# Altium project Control_Devices.PrjPcb (part 2 of 3)
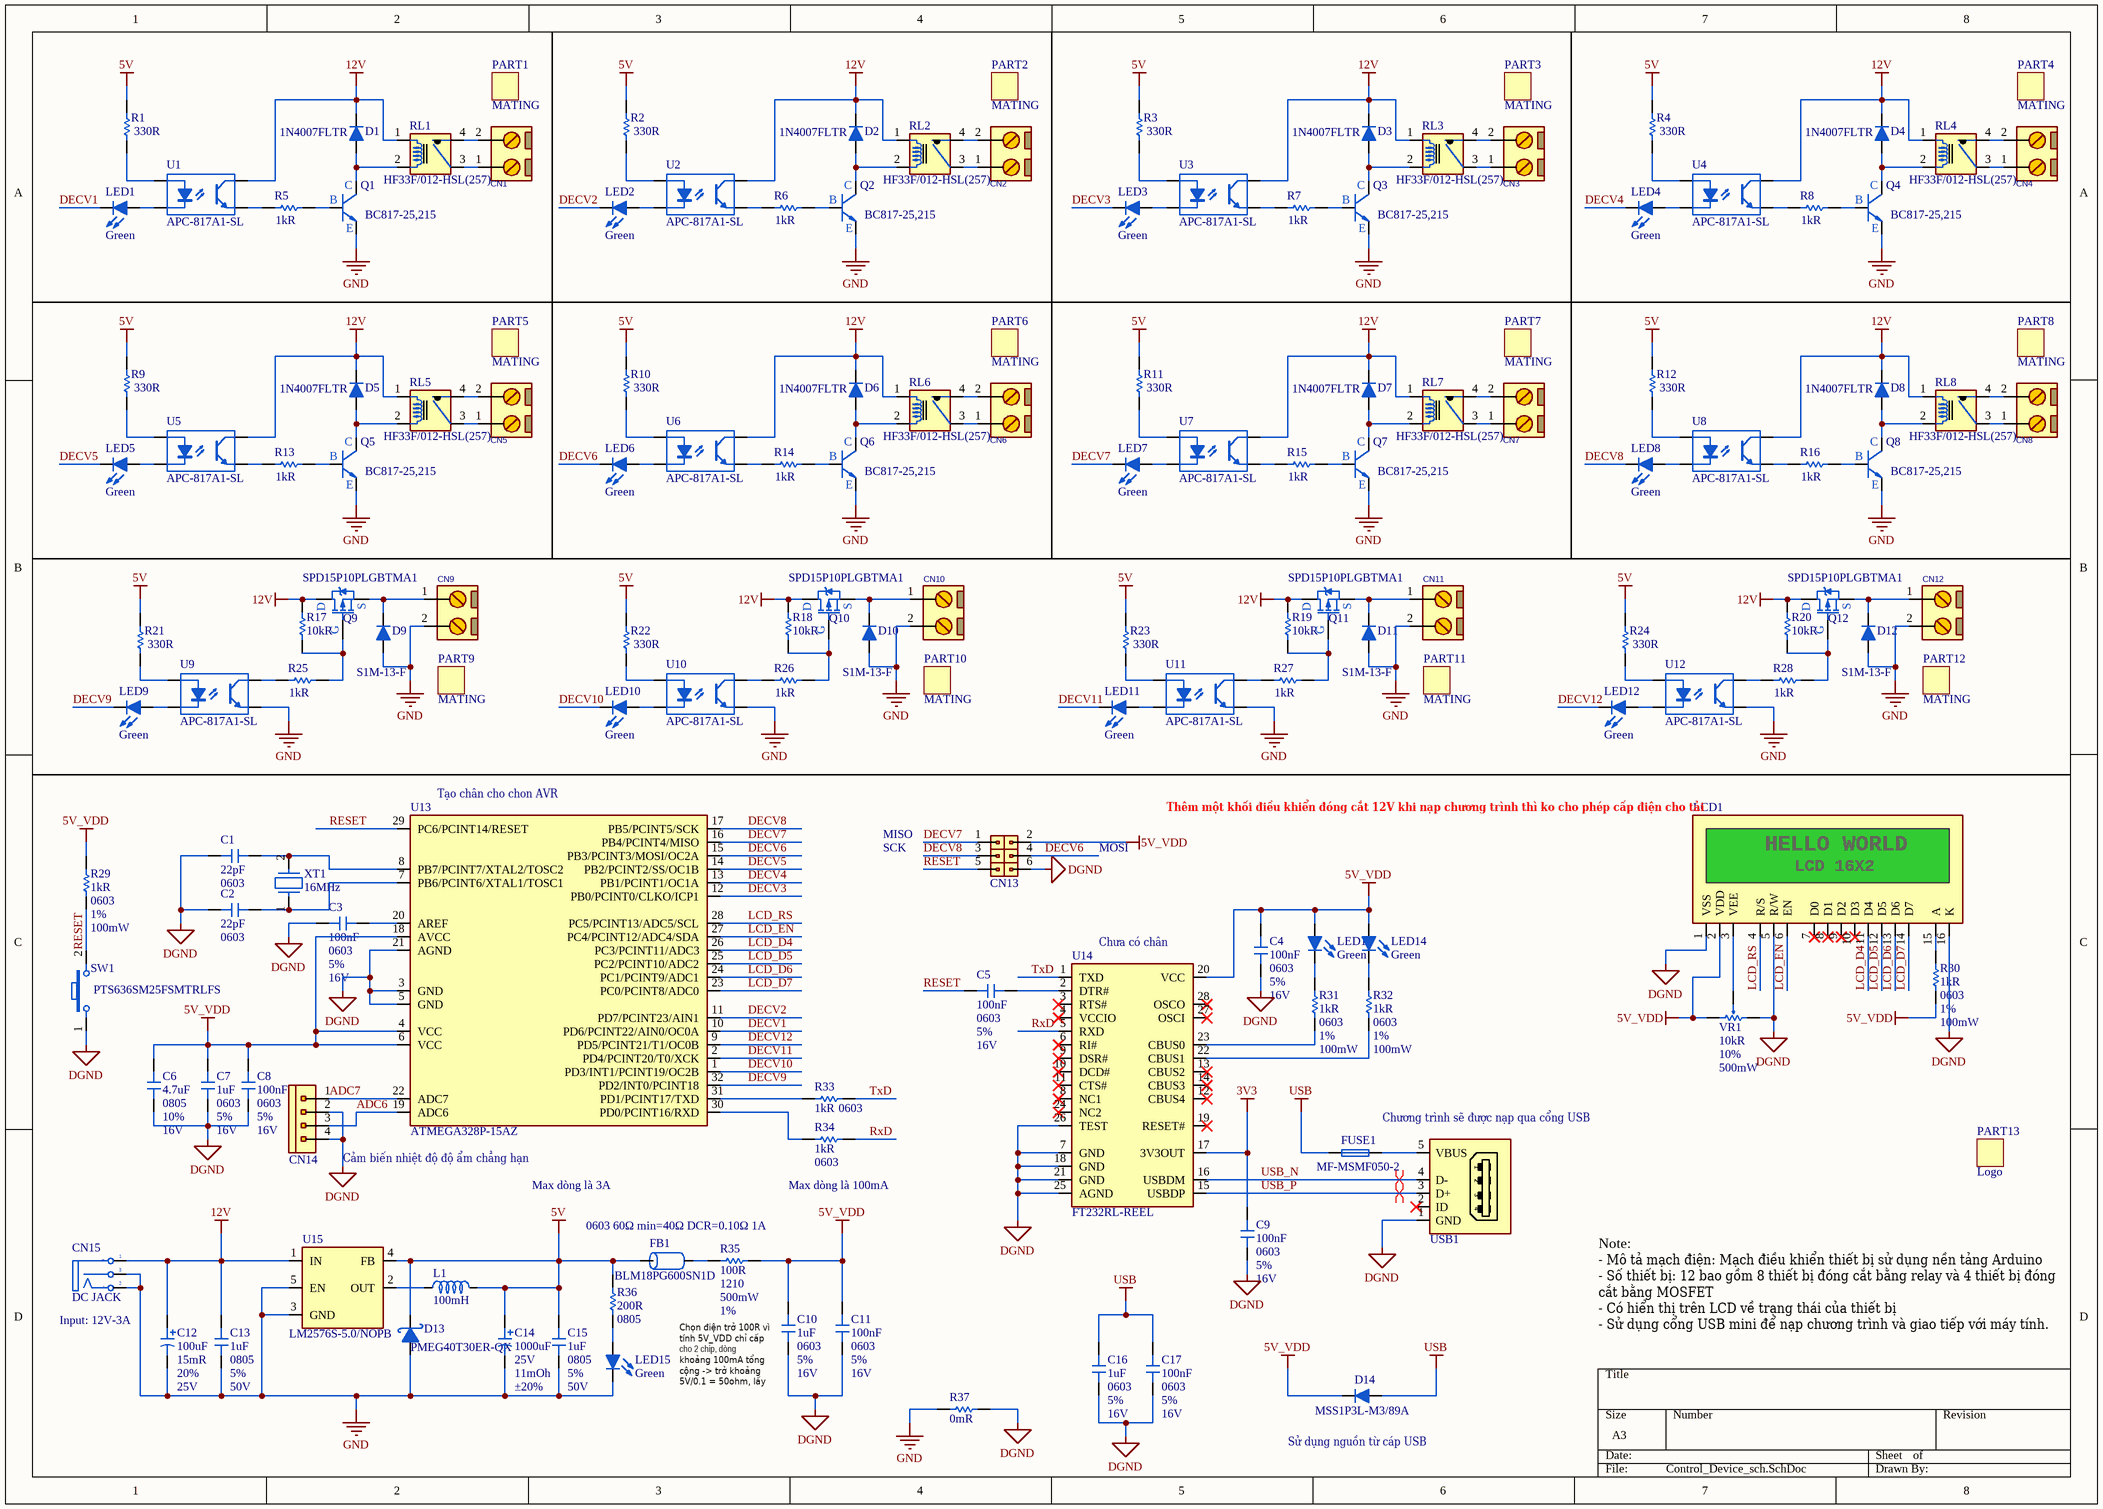
[diagram p1: Control_Device_sch.SchDoc]

## Sheet Control_Device_sch.SchDoc (continued)
### Library data of the parts
C1 C2 = CAP-CER: Surface Mount Ceramic Multilayer Capacitor 22pF 5% C0G 50V 0603 Paper T/R; Manufacturer: Yageo; Manufacturer Part Number: CC0603JRNPO9BN220; Temperature Coefficient: 30ppm/°C; Creator: hoangpt; Publish: 25-Oct-2021; Supplier 1: Future Electronics; Supplier Part Number 1: 2031987; RoHS: Yes; Category: Ceramic Capacitors; Stock 1: 6000000; Pricing 1: 4000=0.0041, 16000=0.0039, 80000=0.0036, 160000=0.0035, 500000=0.0033 (USD); Mount: Surface Mount; Number of Pins: 2; Case Code (Imperial): 0603; Case Code (Metric): 1608; Min Operating Temperature: -55°C; Max Operating Temperature: 125°C; Tolerance: 5%; Capacitance: 22pF; Dielectric: C0G; Voltage Rating: 50V; Voltage Rating (DC): 50V; Packaging: Tape and Reel; Package Quantity: 1; Termination: SMD/SMT; Voltage: 50V; Series: CC; Length: 1.6mm; Width: 0.031inch; Height: 0.8mm; Thickness: 0.035inch; Depth: 0.8mm; Radiation Hardening: No; Reach SVHC Compliant: No; Lead Free: Lead Free; RoHS Compliant: Yes; ComponentLink1URL: https://datasheet.ciiva.com/11786/0900766b8079c870-11786216.pdf?src-supplier=Rs; ComponentLink1Description: https://datasheet.ciiva.com/11786/0900766b8079c870-11786216.pdf?src-supplier=Rs; ComponentLink2URL: https://datasheet.ciiva.com/28450/1443161-28450487.pdf?src-supplier=Element14; ComponentLink2Description: https://datasheet.ciiva.com/28450/1443161-28450487.pdf?src-supplier=Element14; ComponentLink3URL: https://datasheet.ciiva.com/46430/1835847-46430153.pdf?src-supplier=Element14; ComponentLink3Description: https://datasheet.ciiva.com/46430/1835847-46430153.pdf?src-supplier=Element14; ComponentLink4URL: https://datasheet.ciiva.com/144/mlccorderingcode-144632.pdf?src-supplier=Digi-Key; ComponentLink4Description: https://datasheet.ciiva.com/144/mlccorderingcode-144632.pdf?src-supplier=Digi-Key; ComponentLink5URL: https://datasheet.ciiva.com/144/mlccorderingcode-144631.pdf?src-supplier=Digi-Key; ComponentLink5Description: https://datasheet.ciiva.com/144/mlccorderingcode-144631.pdf?src-supplier=Digi-Key; ComponentLink6URL: https://datasheet.ciiva.com/144/mlccorderingcode-144633.pdf?src-supplier=Digi-Key; ComponentLink6Description: https://datasheet.ciiva.com/144/mlccorderingcode-144633.pdf?src-supplier=Digi-Key; ComponentLink7URL: https://datasheet.ciiva.com/8033/1734582-8033749.pdf?src-supplier=Element14; ComponentLink7Description: https://datasheet.ciiva.com/8033/1734582-8033749.pdf?src-supplier=Element14; ComponentLink8URL: https://datasheet.ciiva.com/11464/upy-gp-np0-16v-to-50v-8-11464728.pdf?src-supplier=Avnet; ComponentLink8Description: https://datasheet.ciiva.com/11464/upy-gp-np0-16v-to-50v-8-11464728.pdf?src-supplier=Avnet
C3-C5 C8 C9 C11 C17 = CAP-CER: Cap Ceramic 0.1uF 16V X7R 5% SMD 0603 125C T/R; Manufacturer: Yageo; Manufacturer Part Number: CC0603JRX7R7BB104; Creator: hoangpt; Publish: 25-Oct-2021; Supplier 1: Future Electronics; Supplier Part Number 1: 5822184; RoHS: Yes; Category: Ceramic Capacitors; Stock 1: 28000; Pricing 1: 4000=0.0077, 16000=0.0073, 60000=0.007, 120000=0.0068, 300000=0.0065 (USD); Mount: Surface Mount; Number of Pins: 2; Case Code (Metric): 1608; Case Code (Imperial): 0603; Min Operating Temperature: -55°C; Max Operating Temperature: 125°C; Capacitance: 100nF; Packaging: Tape and Reel; Dielectric: X7R; Voltage Rating (DC): 16V; Series: CC; Length: 0.063inch; Width: 0.031inch; Thickness: 0.035inch; Depth: 0.8mm; Radiation Hardening: No; Lead Free: Lead Free; Halogen Free: Halogen Free; RoHS Compliant: Yes; ComponentLink1URL: https://datasheet.ciiva.com/26862/getdatasheetpartid-403543-26862779.pdf?src-supplier=Verical; ComponentLink1Description: https://datasheet.ciiva.com/26862/getdatasheetpartid-403543-26862779.pdf?src-supplier=Verical
C6 = CAP-CER: 0805 4.7 uF 16 V ±10% Tolerance X5R Multilayer Ceramic Capacitor; Manufacturer: Yageo; Manufacturer Part Number: CC0805KKX5R7BB475; Creator: hoangpt; Publish: 25-Oct-2021; Supplier 1: Future Electronics; Supplier Part Number 1: 8039217; RoHS: Yes; Category: Ceramic Capacitors; Stock 1: 6000; Pricing 1: 3000=0.0693, 6000=0.0675, 9000=0.0665, 15000=0.0652, 30000=0.0625 (USD); Mount: Surface Mount; Case Code (Imperial): 0805; Case Code (Metric): 2012; Min Operating Temperature: -55°C; Max Operating Temperature: 85°C; Capacitance: 4.7uF; Dielectric: X5R; Voltage Rating (DC): 16V; Packaging: Tape and Reel; Termination: SMD/SMT; Dissipation Factor: 10%; Series: CC; Construction: Flat; Length: 2mm; Width: 0.049inch; Height: 1.25mm; Thickness: 0.057inch; Depth: 1.25mm; Radiation Hardening: No; Lead Free: Lead Free; Halogen Free: Halogen Free; RoHS Compliant: Yes; ComponentLink1URL: http://www.mouser.com/ds/2/447/UPY-GPHC_X5R_4V-to-50V_24-1109650.pdf?src-supplier=Mouser; ComponentLink1Description: http://www.mouser.com/ds/2/447/UPY-GPHC_X5R_4V-to-50V_24-1109650.pdf?src-supplier=Mouser; ComponentLink2URL: http://www.yageo.com/documents/recent/UPY-GPHC_X5R_4V-to-50V_25.pdf?src-supplier=Digi-Key; ComponentLink2Description: http://www.yageo.com/documents/recent/UPY-GPHC_X5R_4V-to-50V_25.pdf?src-supplier=Digi-Key; ComponentLink3URL: https://www.yageo.com/upload/media/product/productsearch/datasheet/mlcc/UPY-GPHC_X5R_4V-to-50V_26.pdf?src-supplier=Digi-Key; ComponentLink3Description: https://www.yageo.com/upload/media/product/productsearch/datasheet/mlcc/UPY-GPHC_X5R_4V-to-50V_26.pdf?src-supplier=Digi-Key; ComponentLink4URL: http://www.yageo.com/documents/recent/UPY-GPHC_X5R_4V-to-50V_12.pdf?src-supplier=Avnet; ComponentLink4Description: http://www.yageo.com/documents/recent/UPY-GPHC_X5R_4V-to-50V_12.pdf?src-supplier=Avnet
C7 C10 C16 = CAP-CER: Cap Ceramic 1uF 16V X7R 5% SMD 0603 125°C Paper T/R; Manufacturer: Yageo; Manufacturer Part Number: CC0603JRX7R7BB105; Creator: hoangpt; Publish: 25-Oct-2021; Supplier 1: Arrow Electronics; Supplier Part Number 1: CC0603JRX7R7BB105; RoHS: Yes; Category: Ceramic Capacitors; Stock 1: 1536; Pricing 1: 1=0.2145, 10=0.0953, 25=0.094, 100=0.0576, 250=0.057, 500=0.0534, 1000=0.0487 (USD); Mount: Surface Mount; Case Code (Imperial): 0603; Case Code (Metric): 1608; Min Operating Temperature: -55°C; Max Operating Temperature: 125°C; Packaging: Tape and Reel; Capacitance: 1uF; ComponentLink1URL: http://www.yageo.com/documents/recent/UPY-GPHC_X7R_6.3V-to-50V_18.pdf?src-supplier=Digi-Key; ComponentLink1Description: http://www.yageo.com/documents/recent/UPY-GPHC_X7R_6.3V-to-50V_18.pdf?src-supplier=Digi-Key; ComponentLink2URL: https://www.yageo.com/upload/media/product/productsearch/datasheet/mlcc/UPY-GPHC_X7R_6.3V-to-50V_18.pdf?src-supplier=Digi-Key; ComponentLink2Description: https://www.yageo.com/upload/media/product/productsearch/datasheet/mlcc/UPY-GPHC_X7R_6.3V-to-50V_18.pdf?src-supplier=Digi-Key
C12 = CAP-ELEC: Cap Aluminum Polymer 100uF 25VDC 20% (10 X 12.5mm) Radial 5mm 0.015 Ohm 4500mA 2000h 105C T/R; Manufacturer: Nichicon; Manufacturer Part Number: RNS1E101MDN1PH; Ripple Current: 4.5A; Leakage Current: 500uA; Dissipation Factor: 0.08%; Creator: hoangpt; Publish: 25-Oct-2021; Supplier 1: Arrow Electronics; Supplier Part Number 1: RNS1E101MDN1PH; RoHS: Yes; Category: Polymer Capacitors; Stock 1: 27; Pricing 1: 1=2.502, 10=2.231, 25=2.08 (USD); Mount: Through Hole; Case/Package: Radial; Min Operating Temperature: -55°C; Max Operating Temperature: 105°C; Capacitance: 100uF; Packaging: Tape and Reel; Package Quantity: 1; Voltage Rating (DC): 25V; Termination: Radial; Series: FPCAP, NS; Diameter: 10mm; Length: 12.5mm; Height: 12.5mm; Lead Pitch: 5mm; Height - Seated (Max): 0.551inch; Reach SVHC Compliant: No; RoHS Compliant: Yes; ComponentLink1URL: https://datasheet.ciiva.com/6298/2012fpcap-catalog-all-6298659.pdf?src-supplier=Digi-Key; ComponentLink1Description: https://datasheet.ciiva.com/6298/2012fpcap-catalog-all-6298659.pdf?src-supplier=Digi-Key; ComponentLink2URL: https://datasheet.ciiva.com/12554/2012fpcap-catalog-ns-6061-12554509.pdf?src-supplier=Mouser; ComponentLink2Description: https://datasheet.ciiva.com/12554/2012fpcap-catalog-ns-6061-12554509.pdf?src-supplier=Mouser; ComponentLink3URL: https://datasheet.ciiva.com/28458/1913247-28458902.pdf?src-supplier=Element14; ComponentLink3Description: https://datasheet.ciiva.com/28458/1913247-28458902.pdf?src-supplier=Element14; ComponentLink4URL: https://datasheet.ciiva.com/6300/e-ns-6300664.pdf?src-supplier=Digi-Key; ComponentLink4Description: https://datasheet.ciiva.com/6300/e-ns-6300664.pdf?src-supplier=Digi-Key
C13 C15 = CAP-CER: 0805 1 uF 50 V ±5 % Tolerance X7R Surface Mount Multilayer Ceramic Capacitor; Manufacturer: Yageo; Manufacturer Part Number: CC0805JKX7R9BB105; Creator: hoangpt; Publish: 25-Oct-2021; Supplier 1: Arrow Electronics; Supplier Part Number 1: CC0805JKX7R9BB105; RoHS: Yes; Category: Ceramic Capacitors; Stock 1: 1222; Pricing 1: 1=0.1748, 10=0.125, 25=0.1071, 100=0.0806, 250=0.0799, 500=0.0711, 1000=0.0631 (USD); Mount: Surface Mount; Case Code (Imperial): 0805; Case Code (Metric): 2012; Min Operating Temperature: -55°C; Max Operating Temperature: 125°C; Packaging: Cut Tape; Capacitance: 1uF; Series: CC; ComponentLink1URL: http://www.yageo.com/documents/recent/UPY-GPHC_X7R_6.3V-to-50V_18.pdf?src-supplier=Digi-Key; ComponentLink1Description: http://www.yageo.com/documents/recent/UPY-GPHC_X7R_6.3V-to-50V_18.pdf?src-supplier=Digi-Key
C14 = CAP-ELEC: Cap, 1000Uf, 25V, Alu Elec, Hybrid, Rad Rohs Compliant: Yes; Manufacturer: Panasonic; Manufacturer Part Number: EEHAZSE102UB; Lifetime @ Temp.: 4000 Hrs @ 125°C; Creator: hoangpt; Publish: 25-Oct-2021; Supplier 1: Digi-Key; Supplier Part Number 1: 10-EEH-AZSE102UBCT-ND; RoHS: Yes; Category: Polymer Capacitors; Pricing 1: 1=2.92, 10=2.361, 50=2.06, 100=1.8026 (USD); Capacitance: 1000uF; Lead Spacing: 0.197" (5.00mm); Size / Dimension: 0.394" Dia (10.00mm); Height - Seated (Max): 0.657" (16.70mm)
CN1-CN12 = CONN_PWR_2P: Conn Shrouded Header (2 Sides) M 2 POS 5mm Solder RA Side Entry Thru-Hole Box; Manufacturer: TE Connectivity; Manufacturer Part Number: 282812-2; Number of Positions: 2; Number of Levels: 1; Current: 15A; Voltage: 300V; Shrouded: Yes (With); Interlock: No (Without); Tail Length: 3.5mm; Creator: hoangpt; Publish: 25-Oct-2021; Supplier 1: Mouser; Supplier Part Number 1: 571-282812-2; RoHS: Yes; Category: Uncategorized; Stock 1: 1; Pricing 1: 1=1.06, 10=0.663, 50=0.663, 100=0.499, 1000=0.403, 10000=0.282 (USD); Mount: Through Hole; Contact Plating: Tin; Color: Green; Contact Material: Copper Alloy; Housing Color: Green; Housing Material: Polyamide; Min Operating Temperature: -40°C; Max Operating Temperature: 110°C; Termination: Solder; Packaging: Box; Series: Buchanan; Number of Rows: 1; Package Quantity: 300; Number of Positions Per Level: 2; Number of Contacts: 2; Current Rating: 15A; Voltage Rating (AC): 300V; Orientation: Right Angle; Connector Type: Header; Max Current Rating: 15A; Screw Flange: No (Without); Screwless Terminal Block: No (Without); Side Stackable: No (Without); Closed End: No (Without); Max Voltage Rating (AC): 300V; Number of Poles: 2; Length: 10mm; Pitch: 5mm; Depth: 12mm; Radiation Hardening: No; Flammability Rating: UL94 V-0; RoHS Compliant: Yes; ELV: Compliant; Lead Free: Lead Free; ComponentLink1URL: https://datasheet.ciiva.com/16308/282812-2-16308394.pdf?src-supplier=Future+Electronics; ComponentLink1Description: https://datasheet.ciiva.com/16308/282812-2-16308394.pdf?src-supplier=Future+Electronics; ComponentLink2URL: https://datasheet.ciiva.com/30206/eng-cs-1308389-eurostyle-terminal-blocks-0607-30206889.pdf?src-supplier=Onlinecomponents.com; ComponentLink2Description: https://datasheet.ciiva.com/30206/eng-cs-1308389-eurostyle-terminal-blocks-0607-30206889.pdf?src-supplier=Onlinecomponents.com; ComponentLink3URL: https://datasheet.ciiva.com/796/eng-cd-282812-d4-796877.pdf?src-supplier=Digi-Key; ComponentLink3Description: https://datasheet.ciiva.com/796/eng-cd-282812-d4-796877.pdf?src-supplier=Digi-Key; ComponentLink4URL: https://datasheet.ciiva.com/18456/eng-cd-282812-d4-18456709.pdf?src-supplier=Digi-Key; ComponentLink4Description: https://datasheet.ciiva.com/18456/eng-cd-282812-d4-18456709.pdf?src-supplier=Digi-Key
CN13 = CONN_FM_2X3P: CONN HEADER VERT 6POS 2.54MM; Manufacturer: Sullins; Number of Positions: 6; Gender: Male; Creator: hoangpt; Publish: 19-May-2023; Supplier 1: Digi-Key; Supplier Part Number 1: S2012E-03-ND; Manufacturer Part Number: PEC03DAAN; RoHS: Yes; Category: Connectors; Stock 1: 8642; Pricing 1: 1=0.35, 10=0.329, 25=0.282, 50=0.2398, 100=0.2303, 250=0.2068, 500=0.1974 (USD); Mount: Through Hole; Housing Color: Black; Contact Material: Bronze; Housing Material: Plastic; Contact Shape: Square; Contact Finish - Mating: TIN; Insulation Material: PBT; Insulation Color: Black; Min Operating Temperature: -65°C; Max Operating Temperature: 125°C; Number of Rows: 2; Packaging: Bulk; Termination: Solder; Number of Contacts: 6; Series: -; Contact Type: Male Pin; Fastening Type: Pull; Length: 7.62mm; Width: 5.08mm; Height: 2.54mm; Pitch: 2.54mm; Lead Free: Lead Free; RoHS Compliant: Yes; Flammability Rating: UL94 V-0; ComponentLink1URL: https://datasheet.ciiva.com/6889/pxcxxdxxn-dwg-6889261.pdf?src-supplier=Digi-Key; ComponentLink1Description: https://datasheet.ciiva.com/6889/pxcxxdxxn-dwg-6889261.pdf?src-supplier=Digi-Key
CN14 = CONN_JP_4P: PEC Series Single Row 4 Position 2.54 mm Straight Breakaway Header; Manufacturer: Sullins; Manufacturer Part Number: PEC04SAAN; Number of Positions: 4; Gender: Male; Pitch: 2.54mm; Creator: hoangpt; Publish: 29-Oct-2021; Supplier 1: Digi-Key; Supplier Part Number 1: S1012E-04-ND; RoHS: Yes; Category: Connectors; Stock 1: 3558; Pricing 1: 1=0.27, 10=0.257, 25=0.22, 50=0.187, 100=0.1797, 250=0.16132, 500=0.154 (USD); Mount: Through Hole; Housing Color: Black; Contact Material: Bronze; Housing Material: Plastic; Contact Shape: Square; Contact Finish - Mating: TIN; Insulation Material: PBT; Insulation Color: Black; Min Operating Temperature: -65°C; Max Operating Temperature: 125°C; Number of Rows: 1; Packaging: Bulk; Termination: Solder; Number of Contacts: 4; Contact Type: Male Pin; Fastening Type: Pull; Series: -; Length: 10.2mm; Width: 2.54mm; Height: 2.54mm; Lead Free: Lead Free; RoHS Compliant: Yes; Flammability Rating: UL94 V-0; ComponentLink1URL: https://s3.amazonaws.com/catalogspreads-pdf/PAGE112-113%20.100%20MALE%20HDR.pdf?src-supplier=Digi-Key; ComponentLink1Description: https://s3.amazonaws.com/catalogspreads-pdf/PAGE112-113%20.100%20MALE%20HDR.pdf?src-supplier=Digi-Key; ComponentLink2URL: http://www.sullinscorp.com/catalogs/97_Page78-79_HEADER_.100_2.54mm_MALE_BREAKAWAY.pdf?src-supplier=Future+Electronics; ComponentLink2Description: http://www.sullinscorp.com/catalogs/97_Page78-79_HEADER_.100_2.54mm_MALE_BREAKAWAY.pdf?src-supplier=Future+Electronics
CN15 = DC_JACK: 2.0 x 6.5 mm, 2.5 A, Horizontal, Through Hole, Dc Power Jack Connector; Manufacturer: CUI; Manufacturer Part Number: PJ-002A; Shielding: Unshielded; Number of Conductors: 2; Supplier 1: Arrow Electronics; Supplier Part Number 1: PJ-002A; RoHS: Yes; Category: Uncategorized; Stock 1: 1489; Pricing 1: 1=0.596300, 10=0.590400, 25=0.566500, 50=0.534000, 100=0.492400, 250=0.431500, 500=0.406900, 1000=0.341800, 2500=0.292100 (USD); Connector Type: Jack; Termination: Through Hole; Packaging: Bulk; Orientation: Horizontal; Diameter: 2.1mm; Lead Free: Lead Free; RoHS Compliant: Yes; ComponentLink1URL: http://www.mouser.com/ds/2/670/pj-002a-515880.pdf?src-supplier=Mouser; ComponentLink1Description: http://www.mouser.com/ds/2/670/pj-002a-515880.pdf?src-supplier=Mouser; ComponentLink2URL: http://www.cui.com/Product/Resource/FuturePDF/PJ-002A.pdf?src-supplier=Future+Electronics; ComponentLink2Description: http://www.cui.com/Product/Resource/FuturePDF/PJ-002A.pdf?src-supplier=Future+Electronics; ComponentLink3URL: https://www.cui.com/product/resource/digikeypdf/pj-002a.pdf?src-supplier=Digi-Key; ComponentLink3Description: https://www.cui.com/product/resource/digikeypdf/pj-002a.pdf?src-supplier=Digi-Key
D1-D8 = DIODE: Standard Rectifier 1000V SOD-123; Manufacturer: SMC; Creator: hoangpt; Publish: 25-Oct-2021; Supplier 1: Future Electronics; Supplier Part Number 1: 8135663; Manufacturer Part Number: 1N4007FLTR; RoHS: No; Stock 1: 240000; Pricing 1: 3000=0.0145, 12000=0.0138, 45000=0.0133, 90000=0.013, 225000=0.0124 (USD)
D9-D12 = DIODE: VR=1000V IF=1A 10pF Trr=3us; Manufacturer: Diodes; Forward Current: 1A; Max Repetitive Reverse Voltage (Vrrm): 1kV; Max Reverse Current: 5uA; Peak Non-Repetitive Surge Current: 30A; Reverse Recovery Time: 3us; Polarity: Standard; Forward Voltage: 1.1V; Recovery Time: 1.8us; Creator: hoangpt; Publish: 25-Oct-2021; Supplier 1: Future Electronics; Supplier Part Number 1: 3385689; Manufacturer Part Number: S1M-13-F; RoHS: Yes; Category: Rectifier Diodes; Stock 1: 4194; Pricing 1: 1=0.192, 20=0.14, 100=0.112, 500=0.0842, 2500=0.0563 (USD); Case/Package: SMA; Number of Pins: 2; Weight: 0.002258oz; Min Operating Temperature: -65°C; Max Operating Temperature: 150°C; Packaging: Tape and Reel; Max Forward Surge Current (Ifsm): 30A; Package Quantity: 5000; Average Rectified Current: 1A; Voltage Rating (DC): 1kV; Current Rating: 1A; Output Current: 1A; Max Reverse Voltage (DC): 1kV; Series: -; Capacitance: 10pF; Reverse Voltage (DC): 1kV; Termination: SMD/SMT; Length: 4.6mm; Width: 2.92mm; Height: 2.1mm; Radiation Hardening: No; Reach SVHC Compliant: No; Lead Free: Lead Free; RoHS Compliant: Yes; ComponentLink1URL: https://datasheet.ciiva.com/34302/1541642-34302418.pdf?src-supplier=Jameco; ComponentLink1Description: https://datasheet.ciiva.com/34302/1541642-34302418.pdf?src-supplier=Jameco; ComponentLink2URL: https://datasheet.ciiva.com/22695/1911706-22695834.pdf?src-supplier=Element14; ComponentLink2Description: https://datasheet.ciiva.com/22695/1911706-22695834.pdf?src-supplier=Element14
D13 = DIODE_SCHOTTKY: PMEG40T30ER-Q - 40 V, 3 A low Trench MEGA Schottky barrier rectifier; Manufacturer: Nexperia; Creator: hoangpt; Publish: 25-Oct-2021; Supplier 1: Digi-Key; Supplier Part Number 1: 1727-PMEG40T30ER-QXCT-ND; Manufacturer Part Number: PMEG40T30ER-QX; RoHS: No; Category: Uncategorized; Stock 1: 2765; Pricing 1: 1=0.43, 10=0.349, 100=0.2373, 500=0.17798, 1000=0.13349 (USD)
D14 = DIODE: VR=30V IF=1A 65pF; Manufacturer: Vishay Semiconductors; Max Surge Current: 25A; Average Rectified Current: 1A; Max Reverse Voltage (DC): 30V; Max Reverse Current: 250uA; Forward Voltage: 500mV; Creator: hoangpt; Publish: 25-Oct-2021; Supplier 1: Mouser; Supplier Part Number 1: 625-MSS1P3L-M3; Manufacturer Part Number: MSS1P3L-M3/89A; RoHS: Yes; Category: Rectifier Diodes; Stock 1: 32299; Pricing 1: 1=0.32, 10=0.246, 50=0.246, 100=0.14, 500=0.092, 1000=0.057, 2500=0.054, 9000=0.053, 10000=0.053 (USD); Mount: Surface Mount; Number of Pins: 2; Min Operating Temperature: -55°C; Max Operating Temperature: 150°C; Packaging: Tape and Reel; Series: eSMP®; Forward Current: 1A; Max Repetitive Reverse Voltage (Vrrm): 30V; Package Quantity: 4500; Peak Non-Repetitive Surge Current: 25A; Max Reverse Leakage Current: 250uA; Max Forward Surge Current (Ifsm): 25A; Length: 0.09inch; Width: 0.055inch; Height: 0.018inch; Radiation Hardening: No; RoHS Compliant: Yes; Lead Free: Lead Free; Reach SVHC Compliant: Unknown; ComponentLink1URL: https://datasheet.ciiva.com/23642/mss1p3l-23642464.pdf?src-supplier=Newark; ComponentLink1Description: https://datasheet.ciiva.com/23642/mss1p3l-23642464.pdf?src-supplier=Newark; ComponentLink2URL: https://datasheet.ciiva.com/7962/mss1p3l-7962344.pdf?src-supplier=Element14; ComponentLink2Description: https://datasheet.ciiva.com/7962/mss1p3l-7962344.pdf?src-supplier=Element14; ComponentLink3URL: https://datasheet.ciiva.com/8290/mss1p3l-8290391.pdf?src-supplier=Avnet; ComponentLink3Description: https://datasheet.ciiva.com/8290/mss1p3l-8290391.pdf?src-supplier=Avnet; ComponentLink4URL: https://datasheet.ciiva.com/16464/mss1p3l-16464118.pdf?src-supplier=Future+Electronics; ComponentLink4Description: https://datasheet.ciiva.com/16464/mss1p3l-16464118.pdf?src-supplier=Future+Electronics; ComponentLink5URL: https://datasheet.ciiva.com/917/mss1p3l-917252.pdf?src-supplier=Digi-Key; ComponentLink5Description: https://datasheet.ciiva.com/917/mss1p3l-917252.pdf?src-supplier=Digi-Key; ComponentLink6URL: https://datasheet.ciiva.com/917/mss1p3l-917253.pdf?src-supplier=Digi-Key; ComponentLink6Description: https://datasheet.ciiva.com/917/mss1p3l-917253.pdf?src-supplier=Digi-Key; ComponentLink7URL: https://datasheet.ciiva.com/917/mss1p3l-917251.pdf?src-supplier=Digi-Key; ComponentLink7Description: https://datasheet.ciiva.com/917/mss1p3l-917251.pdf?src-supplier=Digi-Key
FB1 = FERRITE BEAD: 0603 60Ω min=40Ω DCR=0.10Ω 1A; Manufacturer: Murata; Manufacturer Series: BLM18P; Material: Steel,Ferrite; Impedance: 60R; Max DC Current: 500mA; DC Resistance (DCR): 100mR; Tolerance: 25%; Test Frequency: 100MHz; Number of Lines: 1; Shielding: Unshielded; Creator: hoangpt; Publish: 25-Oct-2021; Supplier 1: Arrow Electronics; Supplier Part Number 1: BLM18PG600SN1D; Manufacturer Part Number: BLM18PG600SN1D; RoHS: Yes; Category: Ferrite Beads and Chips; Stock 1: 104000; Pricing 1: 4000=0.0206, 8000=0.0191, 12000=0.0178, 28000=0.0176, 100000=0.0168 (USD); Case/Package: 0603; Number of Pins: 2; Core Material: Ferrite; Case Code (Metric): 1608; Case Code (Imperial): 0603; Terminal Finish: Tin; Min Operating Temperature: -55°C; Max Operating Temperature: 125°C; Resistance: 100mR; Max Current Rating: 500mA; Package Quantity: 1; Packaging: Tape and Reel; Current Rating: 500mA; ESR (Equivalent Series Resistance): 60R; Termination: SMD/SMT; Frequency: 100MHz; Number of Circuits: 1; Series: BLM18P; Number of Functions: 1; DC Resistance-Max: 100mR; Length: 1.6mm; Width: 0.8mm; Height: 0.8mm; Depth: 0.8mm; Reach SVHC Compliant: No; Lead Free: Lead Free; RoHS Compliant: Yes; ComponentLink1URL: https://datasheet.ciiva.com/11799/0900766b81275ca5-11799788.pdf?src-supplier=Rs; ComponentLink1Description: https://datasheet.ciiva.com/11799/0900766b81275ca5-11799788.pdf?src-supplier=Rs; ComponentLink2URL: https://datasheet.ciiva.com/19458/1845072-19458411.pdf?src-supplier=Jameco; ComponentLink2Description: https://datasheet.ciiva.com/19458/1845072-19458411.pdf?src-supplier=Jameco; ComponentLink3URL: https://datasheet.ciiva.com/29347/442418-da-01-en-chip-drossel-0603-60r-0-500ma-1-6x0-8mm-29347993.pdf?src-supplier=Conrad; ComponentLink3Description: https://datasheet.ciiva.com/29347/442418-da-01-en-chip-drossel-0603-60r-0-500ma-1-6x0-8mm-29347993.pdf?src-supplier=Conrad; ComponentLink4URL: https://datasheet.ciiva.com/8021/5148-8021500.pdf?src-supplier=Element14; ComponentLink4Description: https://datasheet.ciiva.com/8021/5148-8021500.pdf?src-supplier=Element14; ComponentLink5URL: https://datasheet.ciiva.com/8021/5148-8021499.pdf?src-supplier=Element14; ComponentLink5Description: https://datasheet.ciiva.com/8021/5148-8021499.pdf?src-supplier=Element14; ComponentLink6URL: https://datasheet.ciiva.com/6212/l0110s0100blm18p-6212536.pdf?src-supplier=Digi-Key; ComponentLink6Description: https://datasheet.ciiva.com/6212/l0110s0100blm18p-6212536.pdf?src-supplier=Digi-Key; ComponentLink7URL: https://datasheet.ciiva.com/6212/l0110s0100blm18p-6212534.pdf?src-supplier=Digi-Key; ComponentLink7Description: https://datasheet.ciiva.com/6212/l0110s0100blm18p-6212534.pdf?src-supplier=Digi-Key; ComponentLink8URL: https://datasheet.ciiva.com/6212/l0110s0100blm18p-6212538.pdf?src-supplier=Digi-Key; ComponentLink8Description: https://datasheet.ciiva.com/6212/l0110s0100blm18p-6212538.pdf?src-supplier=Digi-Key; ComponentLink9URL: https://datasheet.ciiva.com/3081/l0110s0100blm18p-3081639.pdf?src-supplier=Avnet; ComponentLink9Description: https://datasheet.ciiva.com/3081/l0110s0100blm18p-3081639.pdf?src-supplier=Avnet; ComponentLink10URL: https://datasheet.ciiva.com/16200/l0110s0100blm18p-16200763.pdf?src-supplier=Future+Electronics; ComponentLink10Description: https://datasheet.ciiva.com/16200/l0110s0100blm18p-16200763.pdf?src-supplier=Future+Electronics; ComponentLink11URL: https://datasheet.ciiva.com/3081/l0110s0100blm18p-3081638.pdf?src-supplier=Avnet; ComponentLink11Description: https://datasheet.ciiva.com/3081/l0110s0100blm18p-3081638.pdf?src-supplier=Avnet; ComponentLink12URL: https://datasheet.ciiva.com/41449/001172306-da-01-en-drossel-0603-60r0-1-6x0-8mm-4000st-41449669.pdf?src-supplier=Conrad; ComponentLink12Description: https://datasheet.ciiva.com/41449/001172306-da-01-en-drossel-0603-60r0-1-6x0-8mm-4000st-41449669.pdf?src-supplier=Conrad
FUSE1 = FUSE_RESETTABLE: 15VDC 500mA; Manufacturer: Bourns; Max Current Rating: 100A; Voltage Rating (DC): 15V; Trip Current: 1A; Resistance: 150mR; Power Dissipation: 800mW; Time to Trip: 0.15s; Aging: 1000 hr @ +85 °C (Passive); Approvals: UL,CSA,TUV; Creator: hoangpt; Publish: 25-Oct-2021; Supplier 1: Arrow Electronics; Supplier Part Number 1: MF-MSMF050-2; Manufacturer Part Number: MF-MSMF050-2; RoHS: Yes; Category: Fuses; Stock 1: 234000; Pricing 1: 4000=0.1285 (USD); Mount: PCB,Surface Mount; Case/Package: 1812; Number of Pins: 2; Case Code (Metric): 4532; Case Code (Imperial): 1812; Terminal Material: Gold; Min Operating Temperature: -40°C; Max Operating Temperature: 85°C; Packaging: Tape and Reel; Hold Current: 500mA; Series: MF-MSMF; Voltage Rating: 15V; Package Quantity: 1; Operating Supply Voltage: 15V; Current Rating: 100A; Termination: SMD/SMT; Length: 4.73mm; Width: 3.41mm; Height: 0.85mm; Radiation Hardening: No; RoHS Compliant: Yes; Reach SVHC Compliant: No; Lead Free: Lead Free; ComponentLink1URL: https://datasheet.ciiva.com/34302/1164200-34302041.pdf?src-supplier=Jameco; ComponentLink1Description: https://datasheet.ciiva.com/34302/1164200-34302041.pdf?src-supplier=Jameco; ComponentLink2URL: https://datasheet.ciiva.com/1228/1786007-1228155.pdf?src-supplier=Newark; ComponentLink2Description: https://datasheet.ciiva.com/1228/1786007-1228155.pdf?src-supplier=Newark; ComponentLink3URL: https://datasheet.ciiva.com/32426/mf-msmf-series-eng-tds-32426126.pdf?src-supplier=Distrelec; ComponentLink3Description: https://datasheet.ciiva.com/32426/mf-msmf-series-eng-tds-32426126.pdf?src-supplier=Distrelec; ComponentLink4URL: https://datasheet.ciiva.com/22749/1695373-22749079.pdf?src-supplier=Element14; ComponentLink4Description: https://datasheet.ciiva.com/22749/1695373-22749079.pdf?src-supplier=Element14; ComponentLink5URL: https://datasheet.ciiva.com/46395/1695373-46395287.pdf?src-supplier=Element14; ComponentLink5Description: https://datasheet.ciiva.com/46395/1695373-46395287.pdf?src-supplier=Element14; ComponentLink6URL: https://datasheet.ciiva.com/4501/mfmsmf-72300-4501655.pdf?src-supplier=Mouser; ComponentLink6Description: https://datasheet.ciiva.com/4501/mfmsmf-72300-4501655.pdf?src-supplier=Mouser; ComponentLink7URL: https://datasheet.ciiva.com/14537/70153434-14537737.pdf?src-supplier=Allied+Electronics; ComponentLink7Description: https://datasheet.ciiva.com/14537/70153434-14537737.pdf?src-supplier=Allied+Electronics; ComponentLink8URL: https://datasheet.ciiva.com/1274/1786007-1274499.pdf?src-supplier=Element14; ComponentLink8Description: https://datasheet.ciiva.com/1274/1786007-1274499.pdf?src-supplier=Element14; ComponentLink9URL: https://datasheet.ciiva.com/1274/1786007-1274498.pdf?src-supplier=Element14; ComponentLink9Description: https://datasheet.ciiva.com/1274/1786007-1274498.pdf?src-supplier=Element14; ComponentLink10URL: https://datasheet.ciiva.com/3019/mfmsmf-3019622.pdf?src-supplier=Avnet; ComponentLink10Description: https://datasheet.ciiva.com/3019/mfmsmf-3019622.pdf?src-supplier=Avnet; ComponentLink11URL: https://datasheet.ciiva.com/16205/mfmsmf-16205994.pdf?src-supplier=Onlinecomponents.com; ComponentLink11Description: https://datasheet.ciiva.com/16205/mfmsmf-16205994.pdf?src-supplier=Onlinecomponents.com; ComponentLink12URL: https://datasheet.ciiva.com/15226/getdatasheetpartid-117168-15226886.pdf?src-supplier=Verical; ComponentLink12Description: https://datasheet.ciiva.com/15226/getdatasheetpartid-117168-15226886.pdf?src-supplier=Verical; ComponentLink13URL: https://datasheet.ciiva.com/3019/mfmsmf-3019621.pdf?src-supplier=Avnet; ComponentLink13Description: https://datasheet.ciiva.com/3019/mfmsmf-3019621.pdf?src-supplier=Avnet; ComponentLink14URL: https://datasheet.ciiva.com/326/mfmsmf-326355.pdf?src-supplier=Digi-Key; ComponentLink14Description: https://datasheet.ciiva.com/326/mfmsmf-326355.pdf?src-supplier=Digi-Key; ComponentLink15URL: https://datasheet.ciiva.com/326/mfmsmf-326356.pdf?src-supplier=Digi-Key; ComponentLink15Description: https://datasheet.ciiva.com/326/mfmsmf-326356.pdf?src-supplier=Digi-Key; ComponentLink16URL: https://datasheet.ciiva.com/326/mfmsmf-326354.pdf?src-supplier=Digi-Key; ComponentLink16Description: https://datasheet.ciiva.com/326/mfmsmf-326354.pdf?src-supplier=Digi-Key
L1 = INDUCTOR_AIR: Manufacturer: Bourns; Manufacturer Part Number: SRN3015C-101M; Tolerance: ±20%; Current Rating: 400mA; DC Resistance (DCR): 4.08Ohm Max; Q @ Freq: 10 @ 100MHz; Frequency - Self Resonant: 13MHz; Creator: hoangpt; Publish: 25-Oct-2021; Supplier 1: Digi-Key; Supplier Part Number 1: 118-SRN3015C-101MCT-ND; RoHS: Yes; Category: Fixed Inductors; Stock 1: 16757; Pricing 1: 1=0.46, 10=0.404, 25=0.3756, 50=0.3178, 100=0.2889, 250=0.27152, 500=0.24264, 1000=0.19642 (USD); RoHS Compliant: Yes; Inductance: 100mH; Supplier Device Package: 3015; Size / Dimension: 0.118" L x 0.118" W (3.00mm x 3.00mm); Height - Seated (Max): 0.059" (1.50mm)
LCD1 = LCD_16X2: 16 x 2 Transflective White LED Backlight LCD Character Module with Heater; Manufacturer: Lumex; Manufacturer Part Number: LCR-U01602DSF/AWH; Operating Supply Voltage: 5V; Resolution (height): 2pixel; Resolution (width): 16pixel; Interface: Parallel; Character Height: 4.35mm; Number of Characters: 32; Background Color: Green; Number Of Characters Per Row: 16; Fluid Type: STN; Creator: hoangpt; Publish: 20-March-2022; Supplier 1: Digi-Key; Supplier Part Number 1: 67-2091-ND; RoHS: Yes; Category: Uncategorized; Stock 1: 1026; Pricing 1: 1=22.48, 10=16.96, 100=14.2462, 500=13.08322 (USD); Mount: Screw; Case/Package: Module; Number of Pins: 18; Color: Grey; Min Operating Temperature: -40°C; Max Operating Temperature: 85°C; Backlight Type: LED; Packaging: Bulk; Package Quantity: 1; Series: -; Reach SVHC Compliant: No; Lead Free: Lead Free; RoHS Compliant: Yes; ComponentLink1URL: https://datasheet.ciiva.com/16495/lcr-u01602dsf-awh-16495851.pdf?src-supplier=Future+Electronics; ComponentLink1Description: https://datasheet.ciiva.com/16495/lcr-u01602dsf-awh-16495851.pdf?src-supplier=Future+Electronics; ComponentLink2URL: https://datasheet.ciiva.com/1640/1458461-1640944.pdf?src-supplier=Farnell; ComponentLink2Description: https://datasheet.ciiva.com/1640/1458461-1640944.pdf?src-supplier=Farnell; ComponentLink3URL: https://datasheet.ciiva.com/5325/lcr-u01602dsf+a-wh-187699-5325714.pdf?src-supplier=Mouser; ComponentLink3Description: https://datasheet.ciiva.com/5325/lcr-u01602dsf+a-wh-187699-5325714.pdf?src-supplier=Mouser; ComponentLink4URL: https://datasheet.ciiva.com/1314/lcr-u01602dsf+a-wh-1314500.pdf?src-supplier=Newark; ComponentLink4Description: https://datasheet.ciiva.com/1314/lcr-u01602dsf+a-wh-1314500.pdf?src-supplier=Newark
LED1-LED15 = LED: LED, Green, SMD 0805, 7.0 mcd, Green Diffused Lens; Manufacturer: VCC CHML; Manufacturer Part Number: CMD17-21VGD/TR8; Luminous Intensity: 7mcd; Viewing Angle: 140°; Forward Voltage: 2.1V; Wavelength: 570nm; Lens Style: Rectangular,Diffused,Tinted,Colored; Forward Current: 20mA; Power Rating: 105mW; Number of Elements: 1; Reverse Voltage (DC): 5V; Creator: hoangpt; Publish: 25-Oct-2021; Supplier 1: Newark; Supplier Part Number 1: 28X2935; RoHS: Yes; Category: LEDs; Stock 1: 11000; Pricing 1: 1=0.198, 4000=0.196, 8000=0.194, 16000=0.193, 24000=0.191 (USD); Mount: Surface Mount; Case/Package: 0805; Number of Pins: 2; Color: Green; Case Code (Metric): 2012; Case Code (Imperial): 0805; Min Operating Temperature: -40°C; Max Operating Temperature: 85°C; Packaging: Tape and Reel; Package Quantity: 1; Illumination Color: Green; Test Current: 20mA; Power Dissipation: 105mW; Number of LEDs: 1; Reverse Voltage: 5V; Length: 2mm; Width: 1.25mm; Height: 1.1mm; Depth: 1.25mm; RoHS Compliant: Yes; Lead Free: Lead Free; Reach SVHC Compliant: Unknown; ComponentLink1URL: https://datasheet.ciiva.com/46391/719069-46391062.pdf?src-supplier=Element14; ComponentLink1Description: https://datasheet.ciiva.com/46391/719069-46391062.pdf?src-supplier=Element14; ComponentLink2URL: https://datasheet.ciiva.com/16437/cmd17-21seriessmtleds0805packagesize-16437018.pdf?src-supplier=Future+Electronics; ComponentLink2Description: https://datasheet.ciiva.com/16437/cmd17-21seriessmtleds0805packagesize-16437018.pdf?src-supplier=Future+Electronics
PART1-PART12 = PART_NO-BOM: Conn Terminal Block F 2 POS 5mm Screw RA Cable Mount 15A/Contact; Manufacturer: TE Connectivity; Manufacturer Part Number: 796640-2; Number of Contacts: 2; Current Rating: 15A; Voltage Rating (AC): 300V; Number of Levels: 1; Shrouded: No (Without); Connector Type: Plug; Side Stackable: Yes (With); Wire Gauge (Max): 30AWG; Thread Size: M3; Approvals: UL; Supplier 1: Avnet; Supplier Part Number 1: 796640-2; RoHS: Yes; Category: Terminal Blocks; Stock 1: 500; Pricing 1: 1=0.82353, 10=0.80033, 30=0.77713, 50=0.75394, 100=0.73074, 250=0.70754, 500=0.68434 (USD); Mount: Free Hanging,Cable; Contact Plating: Tin; Contact Material: Bronze; Color: Green; Housing Material: Polyamide; Housing Color: Green; Min Operating Temperature: -40°C; Max Operating Temperature: 105°C; Number of Rows: 1; Termination: Screw; Packaging: Box; Package Quantity: 300; Number of Positions Per Level: 2; Current: 15A; Voltage: 300V; Number of Positions: 2; Series: Buchanan; Orientation: Right Angle; Max Current Rating: 15A; Interlock: No (Without); Screw Flange: No (Without); Screwless Terminal Block: No (Without); Max Voltage Rating (AC): 300V; Number of Circuits: 2; Number of Poles: 2; Voltage Rating: 300V; Max Supply Voltage (AC): 300V; Length: 10mm; Pitch: 5mm; Wire Gauge (Min): 30AWG; Depth: 18.4mm; Wire/Cable Gauge: 30AWG; Radiation Hardening: No; Flammability Rating: UL94 V-0; RoHS Compliant: Yes; Reach SVHC Compliant: Unknown; ComponentLink1URL: https://datasheet.ciiva.com/795/eng-cd-796640-f11-796640-c-drw-795628.pdf?src-supplier=Digi-Key; ComponentLink1Description: https://datasheet.ciiva.com/795/eng-cd-796640-f11-796640-c-drw-795628.pdf?src-supplier=Digi-Key; ComponentLink2URL: https://datasheet.ciiva.com/30178/eng-cs-1308389-eurostyle-terminal-blocks-0607-30178375.pdf?src-supplier=Onlinecomponents.com; ComponentLink2Description: https://datasheet.ciiva.com/30178/eng-cs-1308389-eurostyle-terminal-blocks-0607-30178375.pdf?src-supplier=Onlinecomponents.com; ComponentLink3URL: https://datasheet.ciiva.com/3141/eng-cs-1308389-eurostyle-terminal-blocks-0607-3141676.pdf?src-supplier=Avnet; ComponentLink3Description: https://datasheet.ciiva.com/3141/eng-cs-1308389-eurostyle-terminal-blocks-0607-3141676.pdf?src-supplier=Avnet
PART13 = PART_NO-BOM: Conn Terminal Block F 2 POS 5mm Screw RA Cable Mount 15A/Contact
Q1-Q8 = NPN: NPN Ic=500mA Vceo=45V hfe=160~400 P=250mW; Manufacturer: Nexperia; Creator: hoangpt; Publish: 25-Oct-2021; Supplier 1: Future Electronics; Supplier Part Number 1: 3113322; Manufacturer Part Number: BC817-25,215; RoHS: Yes; Category: BJTs; Stock 1: 7; Pricing 1: 1=0.136, 15=0.0988, 75=0.0768, 300=0.0578, 1500=0.0357 (USD); RoHS Compliant: Yes
Q9-Q12 = MOSFET-P_ESD: MOSFET, P-CH, 100V, 15A, TO252-3; Transistor Polarity: P Channel; Continuous Drai; Manufacturer: Infineon; Drain to Source Voltage (Vdss): -100V; Rds On Max: 200mR; Input Capacitance: 1.49nF; Max Power Dissipation: 128W; Turn-On Delay Time: 7.6ns; Turn-Off Delay Time: 50ns; Gate to Source Voltage (Vgs): 20V; Rise Time: 21ns; Fall Time: 29ns; Number of Elements: 1; Creator: hoangpt; Publish: 25-Oct-2021; Supplier 1: Mouser; Supplier Part Number 1: 726-SPD15P10PLGBTMA1; Manufacturer Part Number: SPD15P10PLGBTMA1; RoHS: Yes; Category: MOSFETs; Stock 1: 2721; Pricing 1: 1=2.26, 10=2.03, 50=2.03, 100=1.63, 1000=1.11, 10000=1.03 (USD); Mount: Surface Mount; Case/Package: TO-252-3; Min Operating Temperature: -55°C; Max Operating Temperature: 175°C; Packaging: Tape and Reel; Continuous Drain Current (ID): 15A; Series: SIPMOS®; Power Dissipation: 128W; Max Dual Supply Voltage: -100V; RoHS Compliant: Yes; Lead Free: Contains Lead; Halogen Free: Not Halogen Free; ComponentLink1URL: https://datasheet.ciiva.com/14851/spd-p15p10pl-rev1-3-14851412.pdf?src-supplier=Arrow+Electronics; ComponentLink1Description: https://datasheet.ciiva.com/14851/spd-p15p10pl-rev1-3-14851412.pdf?src-supplier=Arrow+Electronics
R1-R4 R9-R12 R21-R24 = RESISTOR: Res General Purpose Thick Film 0603 330 Ohm 5% 1/10W ±100ppm/°C Molded SMD Paper T/R; Manufacturer: Yageo; Manufacturer Part Number: RC0603JR-07330RL; Power Rating: 100mW; Voltage Rating (DC): 50V; Creator: hoangpt; Publish: 25-Oct-2021; Supplier 1: Future Electronics; Supplier Part Number 1: 9830589; RoHS: Yes; Category: Chip SMD Resistors; Stock 1: 4175000; Pricing 1: 5000=0.0012, 75000=0.0011, 250000=0.0011, 750000=0.0011, 2500000=0.001 (USD); Case/Package: 0603; Number of Pins: 2; Case Code (Imperial): 0603; Case Code (Metric): 1608; Size Code: 0603; Min Operating Temperature: -55°C; Max Operating Temperature: 155°C; Resistance: 330R; Tolerance: 5%; Voltage Rating: 50V; Packaging: Tape and Reel; Resistor Type: Thick Film; Temperature Coefficient: 100ppm/°C; Resistance Tolerance: 5%; Package Quantity: 5000; Termination: SMD/SMT; Features: Moisture Resistant; Series: RC; Max Power Dissipation: 100mW; Number of Terminations: 2; Construction: Rectangular; Length: 1.6mm; Width: 0.8mm; Height: 0.45mm; Depth: 0.8mm; Reach SVHC Compliant: No; Lead Free: Lead Free; RoHS Compliant: Yes; Military Standard: Not; ComponentLink1URL: https://datasheet.ciiva.com/46395/443971-46395145.pdf?src-supplier=Element14; ComponentLink1Description: https://datasheet.ciiva.com/46395/443971-46395145.pdf?src-supplier=Element14; ComponentLink2URL: https://datasheet.ciiva.com/12558/rc0603-272842-12558685.pdf?src-supplier=Mouser; ComponentLink2Description: https://datasheet.ciiva.com/12558/rc0603-272842-12558685.pdf?src-supplier=Mouser; ComponentLink3URL: https://datasheet.ciiva.com/7746/1868787-7746487.pdf?src-supplier=Element14; ComponentLink3Description: https://datasheet.ciiva.com/7746/1868787-7746487.pdf?src-supplier=Element14; ComponentLink4URL: https://datasheet.ciiva.com/7746/443971-7746488.pdf?src-supplier=Element14; ComponentLink4Description: https://datasheet.ciiva.com/7746/443971-7746488.pdf?src-supplier=Element14; ComponentLink5URL: https://datasheet.ciiva.com/15189/getdatasheetpartid-342831-15189868.pdf?src-supplier=Verical; ComponentLink5Description: https://datasheet.ciiva.com/15189/getdatasheetpartid-342831-15189868.pdf?src-supplier=Verical
R5-R8 R13-R16 R25-R28 R33 R34 = RESISTOR: Res Thick Film 0603 1K Ohm 1% 1/10W ±100ppm/°C Molded SMD SMD Paper T/R; Manufacturer: Yageo; Manufacturer Part Number: RC0603FR-071KL; Power Rating: 100mW; Voltage Rating: 50V; Creator: hoangpt; Publish: 25-Oct-2021; Supplier 1: Future Electronics; Supplier Part Number 1: 4016291; RoHS: Yes; Category: Chip SMD Resistors; Pricing 1: 5000=0.0015, 50000=0.0014, 200000=0.0014, 625000=0.0013, 2000000=0.0012 (USD); Contact Plating: Tin,Matte; Case Code (Imperial): 0603; Case Code (Metric): 1608; Size Code: 0603; Min Operating Temperature: -55°C; Max Operating Temperature: 155°C; Tolerance: 1%; Resistance: 1kR; Temperature Coefficient: 100ppm/°C; Resistor Type: Thick Film; Packaging: Tape and Reel; Termination: SMD/SMT; Features: Moisture Resistant; Series: RC; Max Power Dissipation: 100mW; Number of Terminations: 2; Technology: THICK FILM; Resistance Tolerance: 1%; Construction: Rectangular; Length: 1.6mm; Height: 0.45mm; Depth: 0.8mm; Reach SVHC Compliant: No; Lead Free: Lead Free; Military Standard: Not; RoHS Compliant: Yes
  R5-R8 R13-R16 R25-R28: Stock 1: 11495000; Case/Package: 0603
  R33 R34: Stock 1: 16680000
R17-R20 = RESISTOR: RES SMD 10K OHM 1% 1/10W 0603; Manufacturer: Yageo; Manufacturer Part Number: RC0603FR-0710KL; Temperature Coefficient: 100ppm/°C; Voltage Rating (DC): 50V; Power Rating: 100mW; Voltage Rating: 75V; Creator: hoangpt; Publish: 25-Oct-2021; Supplier 1: Future Electronics; Supplier Part Number 1: 3349388; RoHS: Yes; Category: Chip SMD Resistors; Stock 1: 232943; Pricing 1: 1=0.1, 20=0.0664, 100=0.0484, 500=0.0304, 2500=0.0124 (USD); Case/Package: 0603; Number of Pins: 2; Case Code (Imperial): 0603; Case Code (Metric): 1608; Weight: 7.1E-05oz; Size Code: 0603; Min Operating Temperature: -55°C; Max Operating Temperature: 155°C; Tolerance: 1%; Resistor Type: Thick Film; Resistance: 10kR; Packaging: Tape and Reel; Termination: SMD/SMT; Features: Moisture Resistant; Series: RC; Max Power Dissipation: 100mW; Number of Terminations: 2; Resistance Tolerance: 1%; Construction: Rectangular; Length: 1.6mm; Width: 0.8mm; Height: 0.45mm; Depth: 0.8mm; Lead Pitch: 0.3mm; Reach SVHC Compliant: No; Lead Free: Lead Free; Military Standard: Not; RoHS Compliant: Yes; ComponentLink1URL: https://datasheet.ciiva.com/7660/38590-7660789.pdf?src-supplier=Element14; ComponentLink1Description: https://datasheet.ciiva.com/7660/38590-7660789.pdf?src-supplier=Element14; ComponentLink2URL: https://datasheet.ciiva.com/7983/443971-7983596.pdf?src-supplier=Element14; ComponentLink2Description: https://datasheet.ciiva.com/7983/443971-7983596.pdf?src-supplier=Element14; ComponentLink3URL: https://datasheet.ciiva.com/22747/443971-22747519.pdf?src-supplier=Element14; ComponentLink3Description: https://datasheet.ciiva.com/22747/443971-22747519.pdf?src-supplier=Element14; ComponentLink4URL: https://datasheet.ciiva.com/46440/1868787-46440891.pdf?src-supplier=Element14; ComponentLink4Description: https://datasheet.ciiva.com/46440/1868787-46440891.pdf?src-supplier=Element14; ComponentLink5URL: https://datasheet.ciiva.com/7746/1738695-7746239.pdf?src-supplier=Element14; ComponentLink5Description: https://datasheet.ciiva.com/7746/1738695-7746239.pdf?src-supplier=Element14; ComponentLink6URL: https://datasheet.ciiva.com/15189/getdatasheetpartid-409289-15189591.pdf?src-supplier=Verical; ComponentLink6Description: https://datasheet.ciiva.com/15189/getdatasheetpartid-409289-15189591.pdf?src-supplier=Verical
R29-R32 = RESISTOR: Res Thick Film 0603 1K Ohm 1% 1/10W ±100ppm/°C Molded SMD SMD Paper T/R; Manufacturer: Yageo; Manufacturer Part Number: RC0603FR-071KL; Voltage Rating: 50V; Creator: hoangpt; Publish: 25-Oct-2021; Supplier 1: Future Electronics; Supplier Part Number 1: 4016291; RoHS: Yes; Category: Chip SMD Resistors; Stock 1: 16680000; Pricing 1: 5000=0.0015, 50000=0.0014, 200000=0.0014, 625000=0.0013, 2000000=0.0012 (USD); Contact Plating: Tin,Matte; Case Code (Imperial): 0603; Case Code (Metric): 1608; Size Code: 0603; Min Operating Temperature: -55°C; Max Operating Temperature: 155°C; Resistance: 1kR; Temperature Coefficient: 100ppm/°C; Resistor Type: Thick Film; Packaging: Tape and Reel; Power Rating: 100mW; Termination: SMD/SMT; Features: Moisture Resistant; Series: RC; Number of Terminations: 2; Technology: THICK FILM; Resistance Tolerance: 1%; Construction: Rectangular; Length: 1.6mm; Height: 0.45mm; Depth: 0.8mm; Reach SVHC Compliant: No; Lead Free: Lead Free; Military Standard: Not; RoHS Compliant: Yes
R35 = RESISTOR: RES SMD 100 OHM 1% 1/2W 1210; Manufacturer: Yageo; Manufacturer Part Number: RC1210FR-07100RL; Voltage Rating: 200V; Temperature Coefficient: 100ppm/°C; Creator: hoangpt; Publish: 25-Oct-2021; Supplier 1: Future Electronics; Supplier Part Number 1: 1243326; RoHS: Yes; Category: Chip SMD Resistors; Stock 1: 230000; Pricing 1: 5000=0.0114, 20000=0.0109, 75000=0.0104, 150000=0.0102, 375000=0.0095 (USD); Mount: Surface Mount; Case Code (Imperial): 1210; Case Code (Metric): 3225; Contact Plating: Tin,Matte; Size Code: 1210; Min Operating Temperature: -55°C; Max Operating Temperature: 155°C; Packaging: Tape and Reel; Package Quantity: 5000; Resistance: 100R; Termination: SMD/SMT; Number of Terminations: 2; Max Power Dissipation: 500mW; Features: Moisture Resistant; Series: RC; Technology: THICK FILM; Length: 3.1mm; Width: 2.6mm; Height: 0.5mm; Depth: 2.6mm; Lead Free: Lead Free; RoHS Compliant: Yes; ComponentLink1URL: https://datasheet.ciiva.com/17422/pyu-rc1210-51-rohs-l-4-17422264.pdf?src-supplier=Future+Electronics; ComponentLink1Description: https://datasheet.ciiva.com/17422/pyu-rc1210-51-rohs-l-4-17422264.pdf?src-supplier=Future+Electronics
R36 = RESISTOR: Res General Purpose Thick Film 0805 200 Ohm 1% 1/8W ±100ppm/°C Molded SMD Paper T/R; Manufacturer: Yageo; Manufacturer Part Number: RC0805FR-07200RL; Voltage Rating (DC): 150V; Power Rating: 125mW; Creator: hoangpt; Publish: 25-Oct-2021; Supplier 1: Future Electronics; Supplier Part Number 1: 6109607; RoHS: Yes; Category: Chip SMD Resistors; Stock 1: 925000; Pricing 1: 5000=0.0027, 25000=0.0025, 125000=0.0023, 375000=0.0022, 1000000=0.0021 (USD); Mount: Surface Mount; Case Code (Metric): 2012; Case Code (Imperial): 0805; Size Code: 0805; Min Operating Temperature: -55°C; Max Operating Temperature: 155°C; Tolerance: 1%; Resistance: 200R; Packaging: Tape and Reel; Temperature Coefficient: 100ppm/°C; Voltage Rating: 150V; Number of Terminations: 2; Termination: SMD/SMT; Max Power Dissipation: 125mW; Features: Moisture Resistant; Series: RC; Construction: Rectangular; Length: 2mm; Depth: 1.25mm; Lead Free: Lead Free; Military Standard: Not; RoHS Compliant: Yes; ComponentLink1URL: https://datasheet.ciiva.com/2519/pyu-r-int-thick-7-2519721.pdf?src-supplier=Digi-Key; ComponentLink1Description: https://datasheet.ciiva.com/2519/pyu-r-int-thick-7-2519721.pdf?src-supplier=Digi-Key; ComponentLink2URL: https://datasheet.ciiva.com/2519/pyu-r-int-thick-7-2519720.pdf?src-supplier=Digi-Key; ComponentLink2Description: https://datasheet.ciiva.com/2519/pyu-r-int-thick-7-2519720.pdf?src-supplier=Digi-Key; ComponentLink3URL: https://datasheet.ciiva.com/15189/getdatasheetpartid-327982-15189926.pdf?src-supplier=Verical; ComponentLink3Description: https://datasheet.ciiva.com/15189/getdatasheetpartid-327982-15189926.pdf?src-supplier=Verical; ComponentLink4URL: https://datasheet.ciiva.com/2519/pyu-r-int-thick-7-2519722.pdf?src-supplier=Digi-Key; ComponentLink4Description: https://datasheet.ciiva.com/2519/pyu-r-int-thick-7-2519722.pdf?src-supplier=Digi-Key; ComponentLink5URL: https://datasheet.ciiva.com/12667/rc0805-12667066.pdf?src-supplier=Mouser; ComponentLink5Description: https://datasheet.ciiva.com/12667/rc0805-12667066.pdf?src-supplier=Mouser
R37 = RESISTOR: RES SMD 0 OHM JUMPER 1/10W 0603; Manufacturer: Yageo; Manufacturer Part Number: RC0603JR-070RL; Tolerance: 1%; Power Rating: 100mW; Voltage Rating (DC): 50V; Temperature Coefficient: 200ppm/°C; Resistance Tolerance: 5%; Creator: hoangpt; Publish: 25-Oct-2021; Supplier 1: Future Electronics; Supplier Part Number 1: 3992146; RoHS: Yes; Category: Chip SMD Resistors; Stock 1: 19050000; Pricing 1: 5000=0.0015, 50000=0.0014, 150000=0.0013, 625000=0.0013, 1500000=0.0012 (USD); Case/Package: 0603; Number of Pins: 2; Contact Plating: Tin,Matte; Case Code (Imperial): 0603; Case Code (Metric): 1608; Size Code: 0603; Min Operating Temperature: -55°C; Max Operating Temperature: 155°C; Resistance: 0mR; Resistor Type: Thick Film; Packaging: Tape and Reel; Termination: SMD/SMT; Series: RC; Technology: THICK FILM; Package Quantity: 5000; Voltage Rating: 50V; Features: Moisture Resistant; Max Power Dissipation: 100mW; Number of Terminations: 2; Construction: Rectangular; Length: 1.6mm; Width: 0.8mm; Height: 0.45mm; Depth: 0.8mm; Lead Free: Lead Free; RoHS Compliant: Yes; Reach SVHC Compliant: Unknown; Military Standard: Not
RL1-RL8 = RELAY_4P: HF33F Series 10 A SPST 12 VDC PCB Mount Subminiature Intermediate Power Relay; Manufacturer: Hongfa; Creator: hoangpt; Publish: 25-Oct-2021; Supplier 1: Future Electronics; Supplier Part Number 1: 8446049; Manufacturer Part Number: HF33F/012-HSL(257); RoHS: Yes; Pricing 1: 1=0.58, 75=0.56, 250=0.54, 750=0.52, 2500=0.48 (USD); Throw Configuration: SPST; Termination: PCB; Lead Free: Lead Free; ComponentLink1URL: https://datasheet.ciiva.com/17091/hf33f-en-17091858.pdf?src-supplier=Future+Electronics; ComponentLink1Description: https://datasheet.ciiva.com/17091/hf33f-en-17091858.pdf?src-supplier=Future+Electronics
SW1 = SW2: PTS636 Series SPST-NO Off-Mom 180 gf Top Actuated F Lead SMT Tactile Switch; Manufacturer: ITT C&K; Creator: hoangpt; Publish: 25-Oct-2021; Supplier 1: Newark; Supplier Part Number 1: 08AK6878; Manufacturer Part Number: PTS636SM25FSMTRLFS; RoHS: Yes; Category: Tactile Switches; Stock 1: 35828; Pricing 1: 1=0.198, 10=0.191, 25=0.183, 50=0.174, 100=0.165, 250=0.155 (USD)
U1-U12 = OPTO_TRANS: DIP4, DC Input, Photo Transistor; Manufacturer: American Bright; Creator: hoangpt; Publish: 25-Oct-2021; Supplier 1: Digi-Key; Supplier Part Number 1: 2007-APC-817A1-SLCT-ND; Manufacturer Part Number: APC-817A1-SL; RoHS: No; Stock 1: 46740; Pricing 1: 1=0.42, 10=0.279, 100=0.1859, 500=0.12854 (USD)